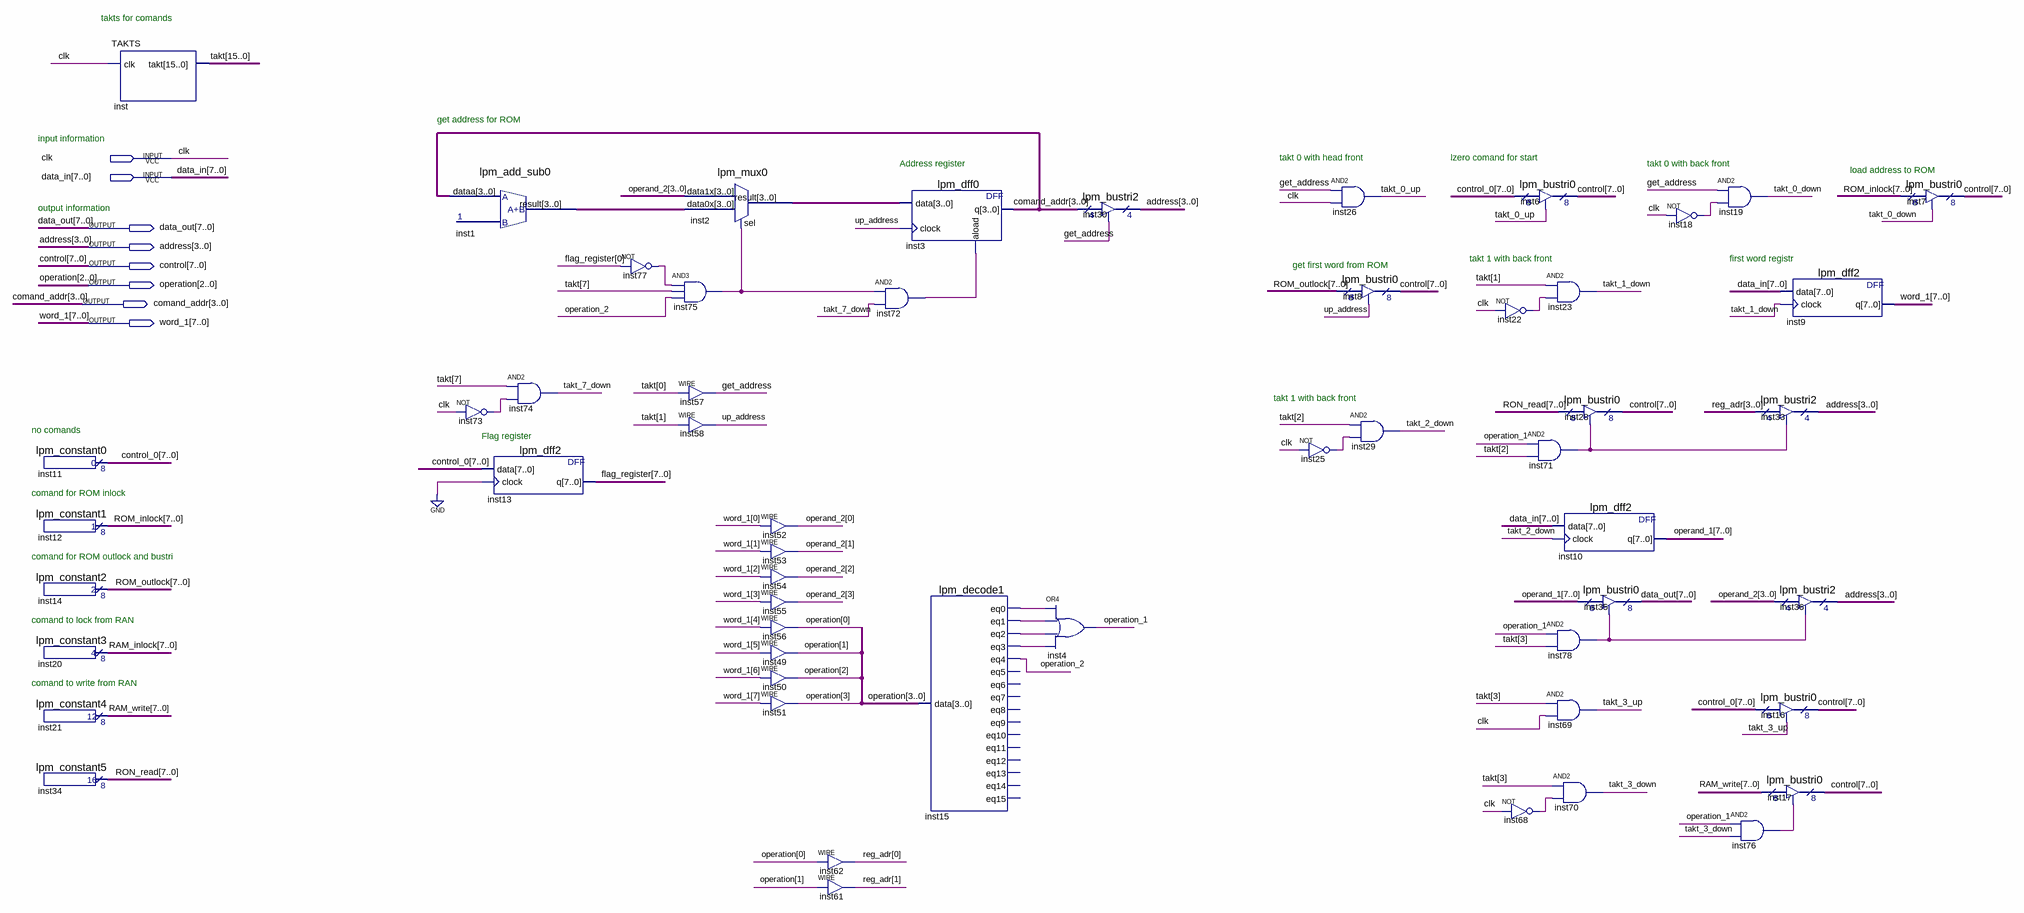
[diagram p0: schematic sheet]
// Quartus schematic CONTROL.bdf as structural Verilog: 55 symbols, 8 pins
module CONTROL (
  input  clk,
  input  [7:0] data_in,
  output [7:0] data_out,
  output [3:0] address,
  output [7:0] control,
  output [3:0] operation,
  output [3:0] comand_addr,
  output [7:0] word_1
);

  wire get_address, inst15_eq0, inst15_eq1, inst15_eq2, inst15_eq3, inst18_out, inst22_out, inst25_out,
       inst68_out, inst71_out, inst72_out, inst73_out, inst75_out, inst76_out, inst77_out, inst78_out,
       operation_1, operation_2, takt_0_down, takt_0_up, takt_1_down, takt_2_down, takt_3_down, takt_3_up,
       takt_7_down, up_address;
  wire [3:0] inst1_result, inst2_result, operand_2, reg_adr;
  wire [7:0] control_0, flag_register, operand_1, RAM_inlock, RAM_write, ROM_inlock, ROM_outlock, RON_read;
  wire [15:0] takt;

  lpm_constant0 inst11 (.result(control_0));
  lpm_constant1 inst12 (.result(ROM_inlock));
  lpm_constant2 inst14 (.result(ROM_outlock));
  lpm_constant3 inst20 (.result(RAM_inlock));
  lpm_constant4 inst21 (.result(RAM_write));
  lpm_constant5 inst34 (.result(RON_read));
  TAKTS inst (.clk(clk), .takt(takt));
  lpm_add_sub0 inst1 (.dataa(comand_addr), .result(inst1_result));
  not inst73 (inst73_out, clk);
  lpm_dff2 inst13 (.data(control_0), .clock(1'b0), .q(flag_register));
  and inst74 (takt_7_down, takt[7], inst73_out);
  not inst77 (inst77_out, flag_register[0]);
  lpm_mux0 inst2 (.data1x(operand_2), .data0x(inst1_result), .sel(inst75_out), .result(inst2_result));
  and inst75 (inst75_out, inst77_out, takt[7], operation_2);
  assign get_address = takt[0];  // WIRE inst57
  assign up_address = takt[1];  // WIRE inst58
  assign operand_2[0] = word_1[0];  // WIRE inst52
  assign operand_2[1] = word_1[1];  // WIRE inst53
  assign operand_2[2] = word_1[2];  // WIRE inst54
  assign operand_2[3] = word_1[3];  // WIRE inst55
  assign operation[0] = word_1[4];  // WIRE inst56
  assign operation[1] = word_1[5];  // WIRE inst49
  assign operation[2] = word_1[6];  // WIRE inst50
  assign operation[3] = word_1[7];  // WIRE inst51
  assign reg_adr[0] = operation[0];  // WIRE inst62
  assign reg_adr[1] = operation[1];  // WIRE inst61
  lpm_dff0 inst3 (.data(inst2_result), .clock(up_address), .aload(inst72_out), .q(comand_addr));
  and inst72 (inst72_out, inst75_out, takt_7_down);
  lpm_decode1 inst15 (
    .data(operation), .eq0(inst15_eq0), .eq1(inst15_eq1), .eq2(inst15_eq2), .eq3(inst15_eq3),
    .eq4(operation_2));  // open: eq5, eq6, eq7, eq8, eq9, eq10, eq11, eq12, eq13, eq14, eq15
  or inst4 (operation_1, inst15_eq0, inst15_eq1, inst15_eq2, inst15_eq3);
  lpm_bustri2 inst30 (.enabledt(get_address), .data(comand_addr), .tridata(address));
  not inst25 (inst25_out, clk);
  and inst26 (takt_0_up, get_address, clk);
  lpm_bustri0 inst8 (.enabledt(up_address), .data(ROM_outlock), .tridata(control));
  and inst29 (takt_2_down, takt[2], inst25_out);
  not inst22 (inst22_out, clk);
  not inst68 (inst68_out, clk);
  lpm_bustri0 inst6 (.enabledt(takt_0_up), .data(control_0), .tridata(control));
  and inst23 (takt_1_down, takt[1], inst22_out);
  lpm_bustri0 inst28 (.enabledt(inst71_out), .data(RON_read), .tridata(control));
  and inst71 (inst71_out, operation_1, takt[2]);
  lpm_dff2 inst10 (.data(data_in), .clock(takt_2_down), .q(operand_1));
  and inst78 (inst78_out, operation_1, takt[3]);
  and inst69 (takt_3_up, takt[3], clk);
  and inst70 (takt_3_down, takt[3], inst68_out);
  lpm_bustri0 inst35 (.enabledt(inst78_out), .data(operand_1), .tridata(data_out));
  not inst18 (inst18_out, clk);
  and inst19 (takt_0_down, get_address, inst18_out);
  lpm_bustri2 inst33 (.enabledt(inst71_out), .data(reg_adr), .tridata(address));
  lpm_bustri0 inst16 (.enabledt(takt_3_up), .data(control_0), .tridata(control));
  lpm_bustri0 inst17 (.enabledt(inst76_out), .data(RAM_write), .tridata(control));
  and inst76 (inst76_out, operation_1, takt_3_down);
  lpm_dff2 inst9 (.data(data_in), .clock(takt_1_down), .q(word_1));
  lpm_bustri2 inst36 (.enabledt(inst78_out), .data(operand_2), .tridata(address));
  lpm_bustri0 inst7 (.enabledt(takt_0_down), .data(ROM_inlock), .tridata(control));

  // Notes on the sheet:
  //   takts for comands
  //   get address for ROM
  //   input information
  //   takt 0 with head front
  //   lzero comand for start
  //   Address register
  //   takt 0 with back front
  //   load address to ROM
  //   output information
  //   takt 1 with back front
  //   first word registr
  //   get first word from ROM
  //   takt 1 with back front
  //   no comands
  //   Flag register
  //   comand for ROM inlock
  //   comand for ROM outlock and bustri
  //   comand to lock from RAN
  //   comand to write from RAN
endmodule
